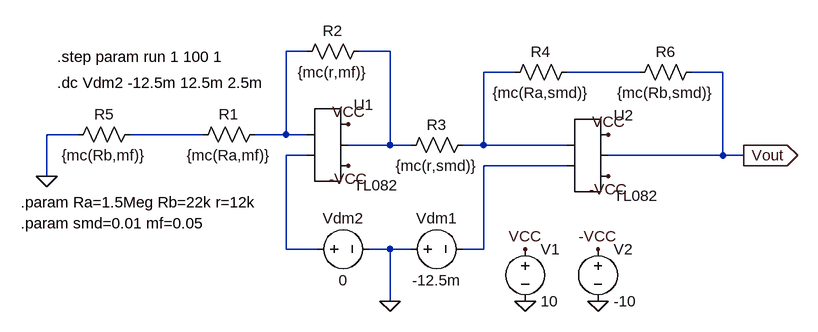
[diagram p0: schematic IA_DM.asc]
IA_DM.asc, the LTspice schematic file:
Version 4
SHEET 1 1312 680
WIRE 160 64 128 64
WIRE 288 64 240 64
WIRE 480 96 432 96
WIRE 672 96 560 96
WIRE 800 96 752 96
WIRE -192 192 -240 192
WIRE 0 192 -112 192
WIRE 128 192 128 64
WIRE 128 192 80 192
WIRE 160 192 128 192
WIRE 288 208 288 64
WIRE 288 208 224 208
WIRE 320 208 288 208
WIRE 432 208 432 96
WIRE 432 208 400 208
WIRE 560 208 432 208
WIRE 160 224 128 224
WIRE 800 224 800 96
WIRE 800 224 624 224
WIRE 832 224 800 224
WIRE 560 240 432 240
WIRE -240 256 -240 192
WIRE 128 368 128 224
WIRE 176 368 128 368
WIRE 288 368 256 368
WIRE 320 368 288 368
WIRE 432 368 432 240
WIRE 432 368 400 368
WIRE 288 448 288 368
FLAG -240 256 0
FLAG 832 224 Vout
IOPIN 832 224 Out
FLAG 496 448 0
FLAG 496 368 VCC
FLAG 624 192 VCC
FLAG 224 176 VCC
FLAG 608 448 0
FLAG 608 368 -VCC
FLAG 224 240 -VCC
FLAG 624 256 -VCC
FLAG 288 448 0
SYMBOL res 96 176 R90
WINDOW 0 0 56 VBottom 2
WINDOW 3 32 56 VTop 2
SYMATTR InstName R1
SYMATTR Value {mc(Ra,mf)}
SYMATTR SpiceLine tol=5 pwr=.125
SYMBOL res 256 48 R90
WINDOW 0 0 56 VBottom 2
WINDOW 3 32 56 VTop 2
SYMATTR InstName R2
SYMATTR Value {mc(r,mf)}
SYMATTR SpiceLine tol=5 pwr=.125
SYMBOL res 416 192 R90
WINDOW 0 0 56 VBottom 2
WINDOW 3 32 56 VTop 2
SYMATTR InstName R3
SYMATTR Value {mc(r,smd)}
SYMATTR SpiceLine tol=5 pwr=1.25
SYMBOL res 576 80 R90
WINDOW 0 0 56 VBottom 2
WINDOW 3 32 56 VTop 2
SYMATTR InstName R4
SYMATTR Value {mc(Ra,smd)}
SYMATTR SpiceLine tol=5 pwr=.125
SYMBOL voltage 496 352 R0
WINDOW 123 0 0 Left 0
WINDOW 39 0 0 Left 0
SYMATTR InstName V1
SYMATTR Value 10
SYMBOL voltage 304 368 R270
WINDOW 0 32 56 VTop 2
WINDOW 3 -32 56 VBottom 2
WINDOW 123 0 0 Left 0
WINDOW 39 0 0 Left 0
SYMATTR InstName Vdm1
SYMATTR Value -12.5m
SYMBOL voltage 160 368 R270
WINDOW 0 32 56 VTop 2
WINDOW 3 -32 56 VBottom 2
WINDOW 123 0 0 Left 0
WINDOW 39 0 0 Left 0
SYMATTR InstName Vdm2
SYMATTR Value 0
SYMBOL voltage 608 352 R0
WINDOW 123 0 0 Left 0
WINDOW 39 0 0 Left 0
SYMATTR InstName V2
SYMATTR Value -10
SYMBOL res -208 208 R270
WINDOW 0 32 56 VTop 2
WINDOW 3 0 56 VBottom 2
SYMATTR InstName R5
SYMATTR Value {mc(Rb,mf)}
SYMBOL res 768 80 R90
WINDOW 0 0 56 VBottom 2
WINDOW 3 32 56 VTop 2
SYMATTR InstName R6
SYMATTR Value {mc(Rb,smd)}
SYMBOL AutoGenerated\\TL082 192 208 R0
SYMATTR InstName U1
SYMBOL AutoGenerated\\TL082 592 224 R0
SYMATTR InstName U2
TEXT -224 112 Left 2 !.dc Vdm2 -12.5m 12.5m 2.5m
TEXT -224 72 Left 2 !.step param run 1 100 1
TEXT -280 296 Left 2 !.param Ra=1.5Meg Rb=22k r=12k
TEXT -280 328 Left 2 !.param smd=0.01 mf=0.05

The netlist it stands for:
* IA_DM.asc
R1 N001 N005 {mc(Ra,mf)} tol=5 pwr=.125
R2 N002 N001 {mc(r,mf)} tol=5 pwr=.125
R3 N003 N002 {mc(r,smd)} tol=5 pwr=1.25
R4 N004 N003 {mc(Ra,smd)} tol=5 pwr=.125
V1 VCC 0 10
Vdm1 0 N007 -12.5m
Vdm2 N006 0 0
V2 -VCC 0 -10
R5 0 N005 {mc(Rb,mf)}
R6 Vout N004 {mc(Rb,smd)}
* U1: TL082 (symbol AutoGenerated\TL082 not available, pins judged from their places): pin1=N001 pin2=N006 pin3=VCC pin4=N002 pin5=-VCC
* U2: TL082 (symbol AutoGenerated\TL082 not available, pins judged from their places): pin1=N003 pin2=N007 pin3=VCC pin4=Vout pin5=-VCC
.dc Vdm2 -12.5m 12.5m 2.5m
.step param run 1 100 1
.param Ra=1.5Meg Rb=22k r=12k
.param smd=0.01 mf=0.05
.backanno
.end